# EAGLE design MFOS Dual VCA Sliders (EAGLE 7.6.0)
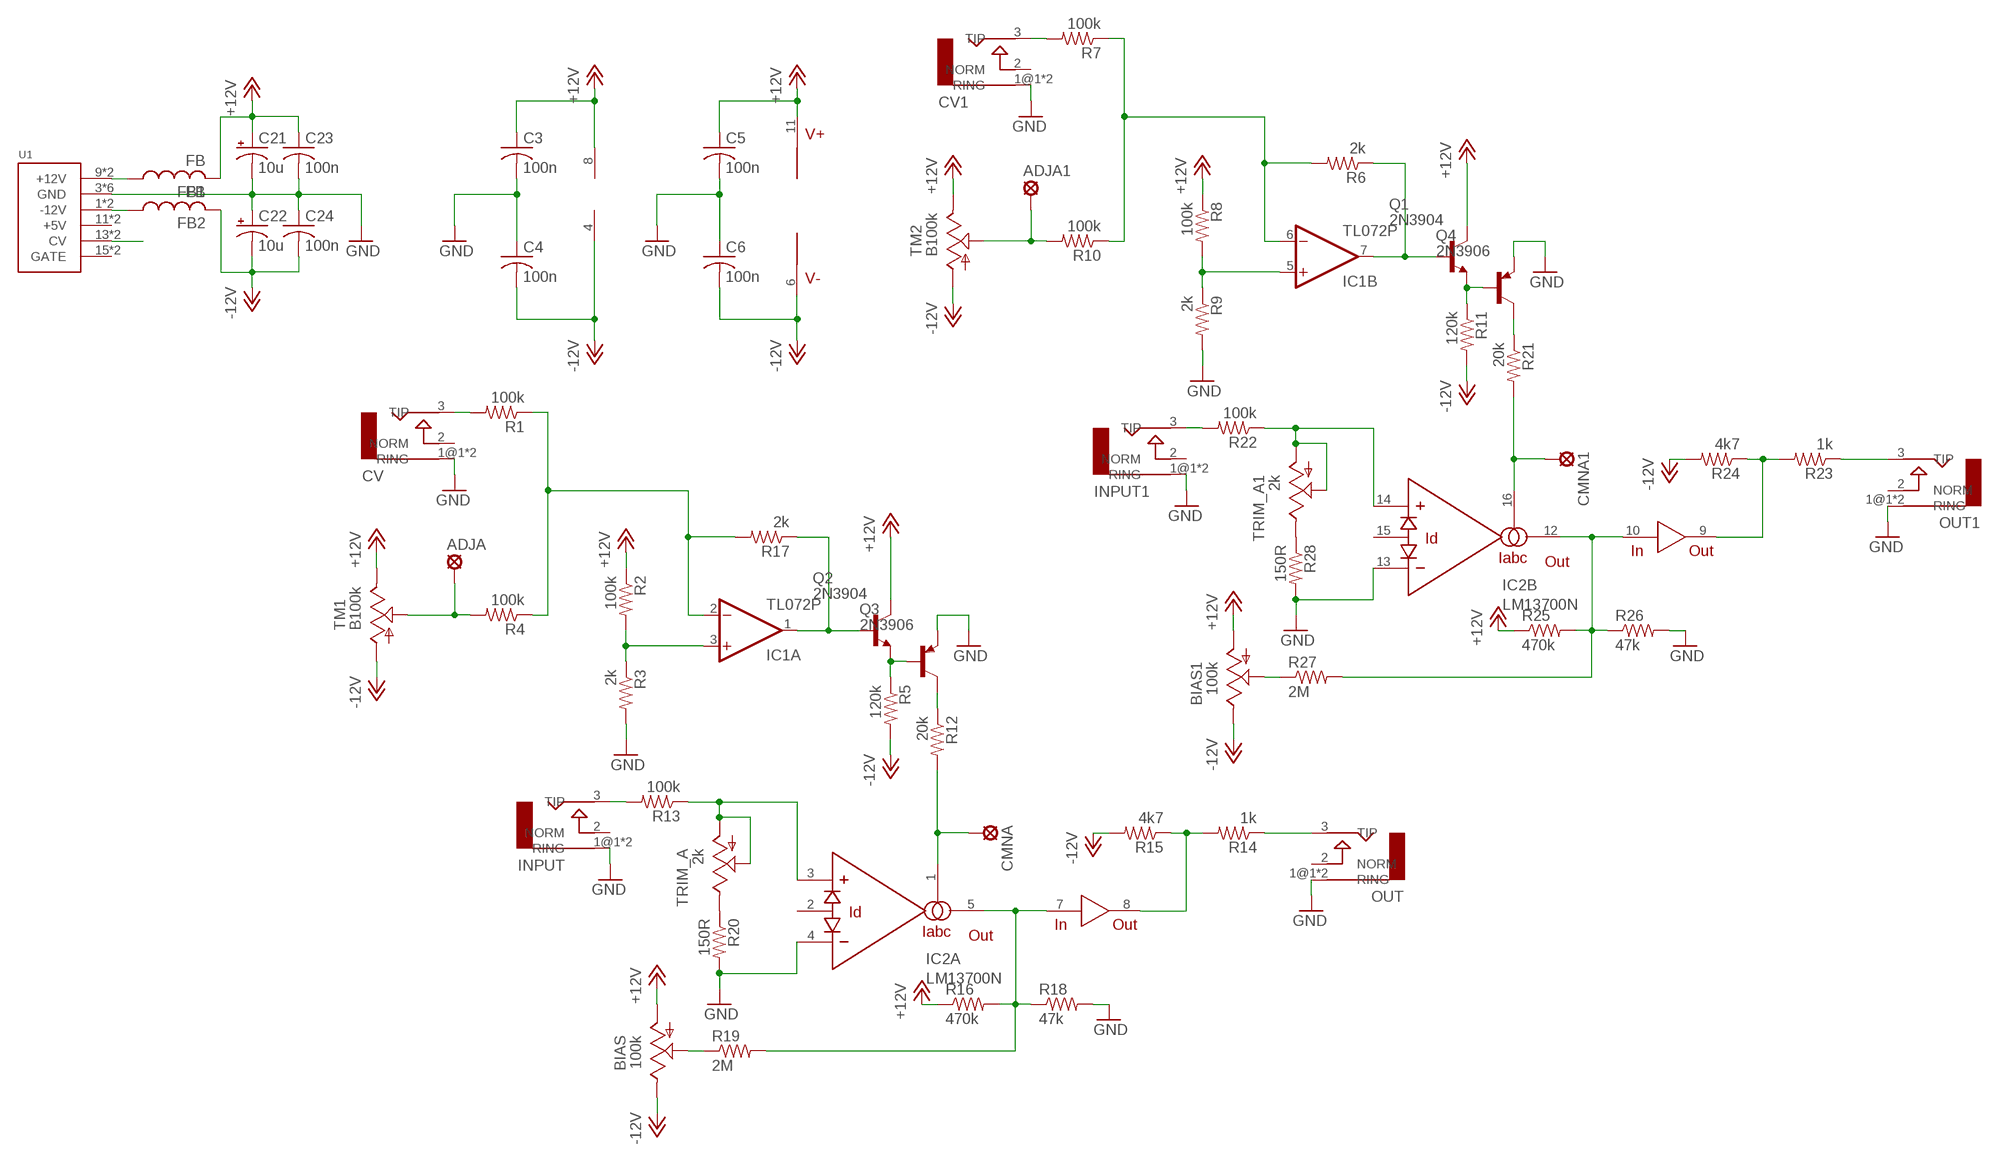
[diagram p0: schematic, sheet 1]

## Parts
ADJA  LSP10  [LSP10]
ADJA1  LSP10  [LSP10]
BIAS  100k  TRIM_US-B64W  [B64W]
BIAS1  100k  TRIM_US-B64W  [B64W]
C3  100n  C-USC1206  [C1206]
C4  100n  C-USC1206  [C1206]
C5  100n  C-USC1206  [C1206]
C6  100n  C-USC1206  [C1206]
C21  10u  CPOL-USB45181A  [B45181A]
C22  10u  CPOL-USB45181A  [B45181A]
C23  100n  C-US050-024X044  [C050-024X044]
C24  100n  C-US050-024X044  [C050-024X044]
CMNA  LSP10  [LSP10]
CMNA1  LSP10  [LSP10]
CV  AUDIO-JACKERTHENVAR  [ERTHENVAR-JACK]
CV1  AUDIO-JACKERTHENVAR  [ERTHENVAR-JACK]
FB1  FB  [FB]
FB2  FB  [FB]
IC1  TL072P  [DIL08]
IC2  LM13700N  [DIL16]
INPUT  AUDIO-JACKERTHENVAR  [ERTHENVAR-JACK]
INPUT1  AUDIO-JACKERTHENVAR  [ERTHENVAR-JACK]
OUT  AUDIO-JACKERTHENVAR  [ERTHENVAR-JACK]
OUT1  AUDIO-JACKERTHENVAR  [ERTHENVAR-JACK]
Q1  2N3904  [TO92]
Q2  2N3904  [TO92]
Q3  2N3906  [TO92]
Q4  2N3906  [TO92]
R1  100k  R-US_R1206  [R1206]
R2  100k  R-US_R1206  [R1206]
R3  2k  R-US_R1206  [R1206]
R4  100k  R-US_R1206  [R1206]
R5  120k  R-US_R1206  [R1206]
R6  2k  R-US_R1206  [R1206]
R7  100k  R-US_R1206  [R1206]
R8  100k  R-US_R1206  [R1206]
R9  2k  R-US_R1206  [R1206]
R10  100k  R-US_R1206  [R1206]
R11  120k  R-US_R1206  [R1206]
R12  20k  R-US_R1206  [R1206]
R13  100k  R-US_R1206  [R1206]
R14  1k  R-US_R1206  [R1206]
R15  4k7  R-US_R1206  [R1206]
R16  470k  R-US_R1206  [R1206]
R17  2k  R-US_R1206  [R1206]
R18  47k  R-US_R1206  [R1206]
R19  2M  R-US_R1206  [R1206]
R20  150R  R-US_R1206  [R1206]
R21  20k  R-US_R1206  [R1206]
R22  100k  R-US_R1206  [R1206]
R23  1k  R-US_R1206  [R1206]
R24  4k7  R-US_R1206  [R1206]
R25  470k  R-US_R1206  [R1206]
R26  47k  R-US_R1206  [R1206]
R27  2M  R-US_R1206  [R1206]
R28  150R  R-US_R1206  [R1206]
TM1  B100k  TRIMSLIDE60  [SLIDEPOT-60]
TM2  B100k  TRIMSLIDE60  [SLIDEPOT-60]
TRIM_A  2k  TRIM_US-B64W  [B64W]
TRIM_A1  2k  TRIM_US-B64W  [B64W]
U1  POWER  [POWER_16]

## Nets
+12V: BIAS1.A BIAS.A C3.1 C5.1 C21.+ C23.1 FB1.P$2 IC1.8(P:V+) IC2.11(V+) Q1.1(C) Q2.1(C) R2.1 R8.1 R16.1 R25.1 TM1.B TM2.B
-12V: BIAS1.E BIAS.E C4.2 C6.2 C22.- C24.2 FB2.P$2 IC1.4(P:V-) IC2.6(V-) R5.2 R11.2 R15.2 R24.2 TM1.A TM2.A
GND: C3.2 C4.1 C5.2 C6.1 C21.- C22.+ C23.2 C24.1 CV1.1@1(RING) CV1.1@2(RING) CV.1@1(RING) CV.1@2(RING) IC2.4(A:-IN) IC2.13(B:-IN) INPUT1.1@1(RING) INPUT1.1@2(RING) INPUT.1@1(RING) INPUT.1@2(RING) OUT1.1@1(RING) OUT1.1@2(RING) OUT.1@1(RING) OUT.1@2(RING) Q3.3(E) Q4.3(E) R3.2 R9.2 R18.2 R20.2 R26.2 R28.2 U1.3(GND) U1.4(GND) U1.5(GND) U1.6(GND) U1.7(GND) U1.8(GND)
N$1: IC1.7(B:OUT) Q1.2(B) R6.1
N$2: IC1.5(B:+IN) R8.2 R9.1
N$3: CV.3(TIP) R1.2
N$4: CV1.3(TIP) R7.2
N$5: ADJA.MP R4.2 TM1.WIPER
N$6: IC1.2(A:-IN) R1.1 R4.1 R17.2
N$7: Q2.3(E) Q3.2(B) R5.1
N$8: IC1.1(A:OUT) Q2.2(B) R17.1
N$9: ADJA1.MP R10.2 TM2.WIPER
N$10: IC1.6(B:-IN) R6.2 R7.1 R10.1
N$11: IC1.3(A:+IN) R2.2 R3.1
N$12: Q3.1(C) R12.1
N$13: INPUT.3(TIP) R13.2
N$14: Q1.3(E) Q4.2(B) R11.1
N$15: Q4.1(C) R21.1
N$16: CMNA.MP IC2.1(A:IABC) R12.2
N$17: INPUT1.3(TIP) R22.2
N$18: BIAS.P$1(S) BIAS.S R19.1
N$19: OUT.3(TIP) R14.1
N$20: IC2.8(OUT) R14.2 R15.1
N$21: IC2.5(A:OUT) IC2.7(IN) R16.2 R18.1 R19.2
N$22: R20.1 TRIM_A.E
N$23: IC2.3(A:+IN) R13.1 TRIM_A.A TRIM_A.P$1(S) TRIM_A.S
N$24: CMNA1.MP IC2.16(B:IABC) R21.2
N$25: IC2.9(OUT) R23.2 R24.1
N$26: OUT1.3(TIP) R23.1
N$27: IC2.10(IN) IC2.12(B:OUT) R25.2 R26.1 R27.2
N$28: BIAS1.P$1(S) BIAS1.S R27.1
N$29: R28.1 TRIM_A1.E
N$30: IC2.14(B:+IN) R22.1 TRIM_A1.A TRIM_A1.P$1(S) TRIM_A1.S
N$55: U1.13(CV) U1.14(CV)
N$61: FB1.P$1 U1.9(+12V) U1.10(+12V)
N$62: FB2.P$1 U1.1(-12V) U1.2(-12V)
Unconnected: CV1.2(NORM) CV.2(NORM) IC2.2(A:ID) IC2.15(B:ID) INPUT1.2(NORM) INPUT.2(NORM) OUT1.2(NORM) OUT.2(NORM) U1.11(+5V) U1.12(+5V) U1.15(GATE) U1.16(GATE)

## Library data of the parts
ADJA ADJA1 CMNA CMNA1 = solpad:LSP10: SOLDER PAD drill 1.0 mm, distributor Buerklin, 12H555
BIAS BIAS1 TRIM_A TRIM_A1 = pot:TRIM_US-: POTENTIOMETER
C3-C6 C23 C24 = rcl:C-US: CAPACITOR, American symbol
C21 C22 = rcl:CPOL-US: POLARIZED CAPACITOR, American symbol
CV CV1 INPUT INPUT1 OUT OUT1 = erthenvar:AUDIO-JACK: Switching Mono 3.5mm Audio Jack from Erthenvar.
FB1 FB2 = adafruit:FB: Ferrite bead Digikey #P9821BK-ND
IC1 = linear:TL072: OP AMP
IC2 = synthdiy updated imperial:LM13700: National Dual OTA with buffers.
Q1 Q2 = transistor-npn:2N3904: NPN Transistor
Q3 Q4 = transistor-pnp:2N3906: PNP Transistor
R1-R28 = rcl:R-US_: RESISTOR, American symbol
TM1 TM2 = stefan-lochbrunner_EAGLE_master_custom libraries_potentiometers_Bourns PTA series_Bourns PTA series:TRIM: Sliding potentiometers Based on Adafruits (https://github.com/adafruit/Adafruit-Eagle-Library) 'TRIM' device. For Bourns PTA series and TT Electronics PSxx series potentiometers.
U1 = eurorack:POWER

## Board
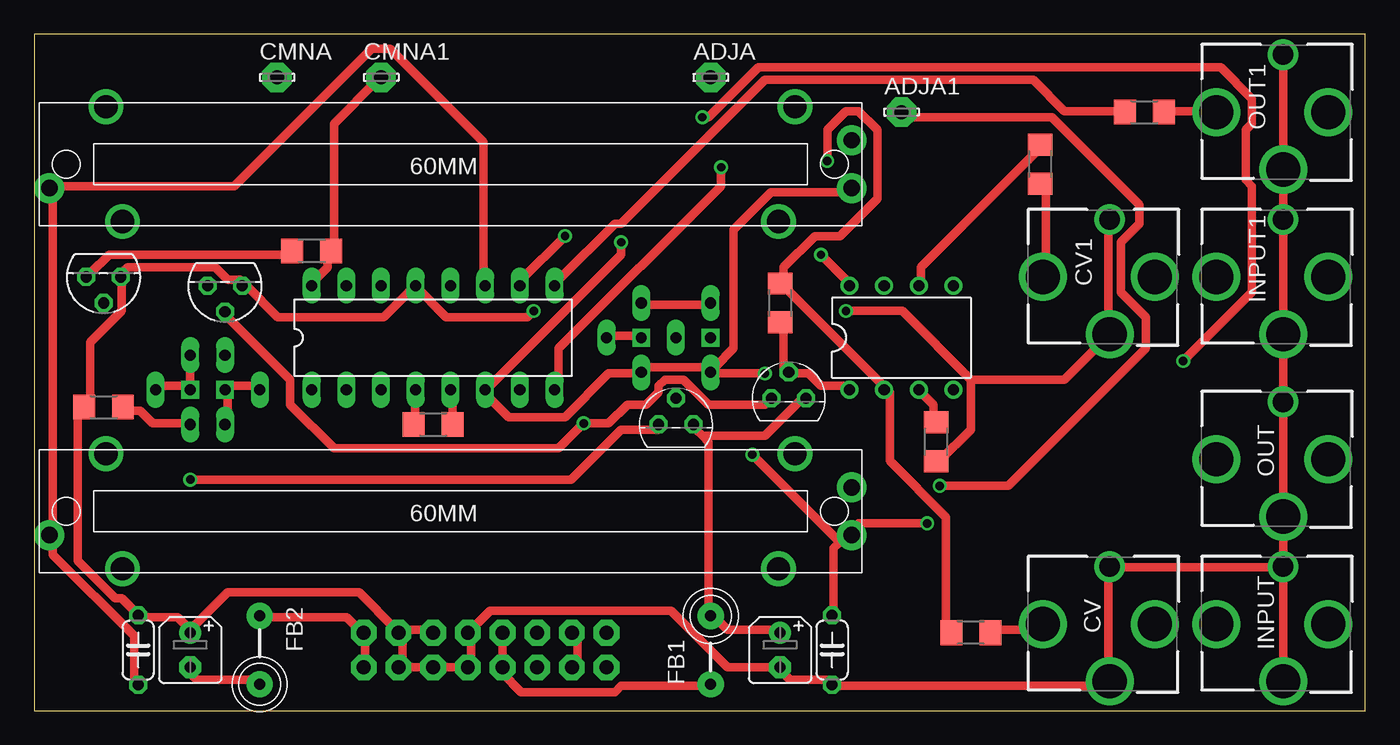
[diagram p1: board, top side]
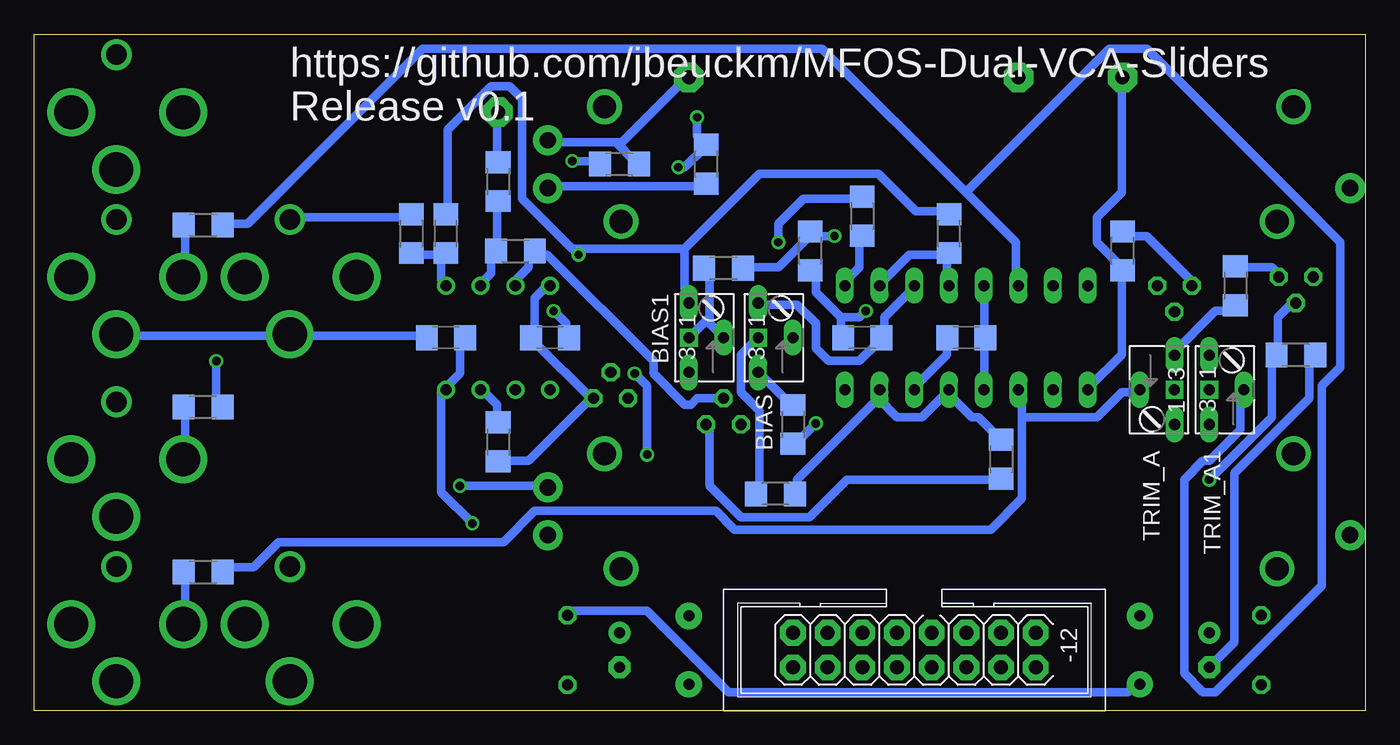
[diagram p2: board, bottom side, seen from below]

Size 97.46 x 49.52 mm. Coordinates in mm from the lower left corner, seen from the top.
Outline: 0,0 97.46,0 97.46,49.52 0,49.52 0,0
Copper layers (1*16): Top 0.035mm / dielectric 1.5mm / Bottom 0.035mm
Design rules "default *": minimum track width 24mil, minimum drill 24mil, track to track 12mil, track to pad 12mil, pad to pad 12mil, via to via 12mil, smd to smd 8mil, copper to edge 10mil, drill to drill 8mil, minimum pad ring 10mil, minimum via ring 8mil, stop-mask expansion 4mil, vias tented up to drill 0mil, thermal gap 10mil

### Footprints (pad centres in the part's own frame; a part is rotated, then mirrored left to right if it is on the bottom)
LSP10 = drill 1.016 pad 2.159 octagon: MP 0,0
B64W = drill 0.813 long: A 2.54,0; E -2.54,0; S 0,-2.54 | drill 0.8 square: P$1 0,0
C1206 = smd 1.6 x 1.8: 1 -1.4,0; 2 1.4,0
B45181A = drill 0.813 pad 1.6: + -1.27,0 | drill 0.813 pad 1.6 octagon: - 1.27,0
C050-024X044 = drill 0.813 octagon: 1 -2.54,0; 2 2.54,0
ERTHENVAR-JACK = drill 2.5: 1@1 -4.2,0; 2 0,-3.3; 3 0,4.9 | drill 1.5: 1@2 4.2,0
FB = drill 0.8 pad 1.93: P$1 -2.5,0; P$2 2.5,0
DIL08 = drill 0.813 pad 1.27: 1 -3.81,-3.81; 2 -1.27,-3.81; 3 1.27,-3.81; 4 3.81,-3.81; 5 3.81,3.81; 6 1.27,3.81; 7 -1.27,3.81; 8 -3.81,3.81
DIL16 = drill 0.813 long: 1 -8.89,-3.81; 2 -6.35,-3.81; 3 -3.81,-3.81; 4 -1.27,-3.81; 5 1.27,-3.81; 6 3.81,-3.81; 7 6.35,-3.81; 8 8.89,-3.81; 9 8.89,3.81; 10 6.35,3.81; 11 3.81,3.81; 12 1.27,3.81; 13 -1.27,3.81; 14 -3.81,3.81; 15 -6.35,3.81; 16 -8.89,3.81
TO92 = drill 0.813 octagon: 1 1.27,0; 2 0,1.905; 3 -1.27,0
R1206 = smd 1.6 x 1.803: 1 -1.422,0; 2 1.422,0
SLIDEPOT-60 = drill 1.2 pad 2.184: A -29.37,1.75; B 29.37,1.75; WIPER -29.37,-1.75 | drill 1.7 pad 2.54: P$1 -24.02,4.2; P$2 24.02,4.2; P$3 -25.22,-4.2; P$4 25.22,-4.2
POWER_16 = drill 1.016 pad 1.88 octagon: 1 -6.35,-1.27; 2 -6.35,1.27; 3 -3.81,-1.27; 4 -3.81,1.27; 5 -1.27,-1.27; 6 -1.27,1.27; 7 1.27,-1.27; 8 1.27,1.27; 9 3.81,-1.27; 10 3.81,1.27; 11 6.35,-1.27; 12 6.35,1.27; 13 8.89,-1.27; 14 8.89,1.27; 15 11.43,-1.27; 16 11.43,1.27

### Placement (x,y rotation side)
ADJA  49.53,46.35 0 top
ADJA1  63.5,43.81 0 top
BIAS  44.45,27.3 90 bottom
BIAS1  49.53,27.3 90 bottom
C3  59.69,27.3 0 bottom
C4  67.31,27.3 0 bottom
C5  36.83,27.3 180 bottom
C6  29.21,27.3 180 bottom
C21  54.61,4.45 270 top
C22  11.43,4.45 270 top
C23  7.62,4.45 90 top
C24  58.42,4.45 90 top
CMNA  17.78,46.35 0 top
CMNA1  25.4,46.35 0 top
CV  78.74,6.35 90 top
CV1  78.74,31.75 90 top
FB1  49.53,4.45 90 top
FB2  16.51,4.45 270 top
IC1  63.5,27.3 0 top
IC2  29.21,27.3 0 top
INPUT  91.44,6.35 90 top
INPUT1  91.44,31.75 90 top
OUT  91.44,18.41 90 top
OUT1  91.44,43.81 90 top
Q1  46.99,20.95 0 top
Q2  55.24,22.86 0 top
Q3  13.97,31.11 180 top
Q4  5.08,31.75 180 top
R1  68.58,5.71 0 top
R2  63.5,19.68 90 bottom
R3  66.04,19.68 270 top
R4  54.61,40.01 0 bottom
R5  41.91,20.95 90 bottom
R6  62.23,33.66 180 bottom
R7  73.66,40.01 270 top
R8  67.31,34.92 270 bottom
R9  69.85,34.92 90 bottom
R10  63.5,38.73 90 bottom
R11  5.08,26.04 0 bottom
R12  17.78,33.66 270 bottom
R13  85.09,10.16 180 bottom
R14  85.09,22.23 0 bottom
R15  48.26,40.01 270 bottom
R16  26.67,18.41 90 bottom
R17  54.61,29.84 90 top
R18  29.21,20.95 180 top
R19  43.18,15.88 0 bottom
R20  9.53,31.11 90 bottom
R21  20.32,33.66 0 top
R22  85.09,35.56 180 bottom
R23  81.28,43.81 180 top
R24  36.83,36.2 90 bottom
R25  30.48,34.92 270 bottom
R26  40.64,33.66 270 bottom
R27  46.99,32.38 0 bottom
R28  5.08,22.23 180 top
TM1  30.48,40.01 180 top
TM2  30.48,14.61 180 top
TRIM_A  13.97,23.5 270 bottom
TRIM_A1  11.43,23.5 90 bottom
U1  30.48,4.45 180 bottom

### Tracks (layer width: path | path; a pad name or v marks a point on that pad's centre or on a via)
+12V  (via drill 0.61)
  Top 0.61: C21.+ 54.41,5.94 50.75,5.94 49.84,6.86 FB1.P$2 49.38,7.32 49.38,19.66 48.92,20.12 | 48.92,20.12 48.46,20.57 Q1.1 | 48.92,20.12 53.49,20.12 56.24,22.86 Q2.1 | C23.1 7.32,2.29 7.32,5.49 1.37,11.43 1.37,12.8 TM2.B 1.37,13.26 1.37,37.95 TM1.B 1.37,38.41 14.63,38.41 24.69,48.46 26.06,48.46 32.92,41.6 32.92,31.55 IC2.11 | BIAS.A 44.81,29.72 49.38,29.72 BIAS1.A | v57.61,33.38 59.44,31.55 IC1.8
  Bottom 0.61: IC1.8 59.89,31.09 60.81,30.18 60.81,27.43 C3.1 60.81,26.98 56.69,22.86 | 56.69,22.86 61.27,18.29 63.09,18.29 R2.1 | 56.69,22.86 Q2.1 | R16.1 26.98,16.92 37.95,16.92 40.69,14.17 45.72,14.17 48.01,16.46 48.01,20.57 Q1.1 | IC2.11 32.92,31.09 35.2,28.8 35.2,27.43 C5.1 35.66,26.98 37.03,25.6 39.32,25.6 40.23,26.52 40.23,28.35 41.6,29.72 44.35,29.72 BIAS.A | 49.84,33.83 44.35,39.32 35.66,39.32 32.92,36.58 30.63,36.58 R25.1 | 49.84,33.83 49.84,30.18 BIAS1.A | 49.84,33.83 57.61,33.83 | 57.61,33.83 58.06,33.83 61.72,37.49 61.72,44.81 62.64,45.72 64.01,45.72 67.21,42.52 67.21,36.58 R8.1 | 57.61,33.83 v57.61,33.38
-12V  (via drill 0.61)
  Top 0.61: BIAS1.E 49.38,25.15 44.81,25.15 BIAS.E 44.35,24.69 42.06,24.69 38.86,21.49 34.75,21.49 32.92,23.32 IC2.6 33.38,23.77 42.98,33.38 v42.98,34.29 | TM1.A 59.44,37.95 53.95,37.95 51.21,35.2 51.21,26.52 49.84,25.15 BIAS1.E | 58.98,12.34 59.44,12.8 TM2.A | 58.98,12.34 58.52,11.89 58.52,7.32 C24.2 | v65.38,13.72 60.35,13.72 59.89,13.26 TM2.A | FB2.P$2 16.46,2.29 11.89,2.29 11.43,2.74 C22.- | v53.49,24.69 49.84,24.69 BIAS1.E | 58.98,12.34 v52.58,18.75 | 58.98,12.34 TM2.A
  Bottom 0.61: R15.2 48.46,38.41 59.44,38.41 TM1.A | R5.2 42.06,22.4 44.35,24.69 BIAS.E | C6.2 30.63,26.98 30.63,26.06 32.92,23.77 IC2.6 | v42.98,34.29 42.98,35.66 41.15,37.49 37.03,37.49 R24.2 | C4.2 66.29,26.98 66.29,24.69 67.21,23.77 IC1.4 67.67,23.32 67.67,16 v65.38,13.72 | R11.2 4.12,25.6 4.12,22.86 9.6,17.37 9.6,5.03 11.43,3.2 C22.- | C24.2 58.06,7.32 52.58,7.32 46.63,1.37 17.37,1.37 16.92,1.83 FB2.P$2 | v53.49,24.69 52.58,23.77 v52.58,18.75
GND  (via drill 0.61)
  Top 0.61: R18.2 27.89,21.03 27.89,23.32 IC2.4 | v36.58,29.26 36.12,28.8 30.18,28.8 27.89,31.09 | 26.98,3.2 28.8,3.2 U1.6 29.26,3.2 31.55,3.2 U1.8 32,3.2 32,5.49 U1.7 32,5.94 33.38,7.32 46.63,7.32 50.75,3.2 54.41,3.2 C21.- 54.86,2.74 55.32,2.29 58.06,2.29 C24.1 58.52,1.83 78.64,1.83 CV.1@1 78.64,2.29 78.64,10.52 CV.1@2 79.1,10.52 91.44,10.52 | U1.3 26.98,5.94 28.8,5.94 U1.5 | 26.98,3.2 26.98,5.49 U1.3 | 26.98,3.2 U1.4 | 11.43,5.94 10.52,6.86 7.77,6.86 C23.2 7.32,7.32 6.4,8.23 5.94,8.23 3.2,10.97 3.2,21.49 3.66,21.95 R28.2 4.12,22.4 4.12,26.98 6.4,29.26 6.4,31.55 Q4.3 6.4,32 6.86,32.46 13.26,32.46 14.17,31.55 15.09,31.55 Q3.3 15.54,31.09 17.83,28.8 25.6,28.8 27.89,31.09 | 11.43,5.94 14.17,8.69 23.77,8.69 26.52,5.94 U1.3 | 11.43,5.94 C22.+ | 27.89,31.09 IC2.13 | v59.44,29.26 63.55,29.26 68.58,24.23 | 68.58,24.23 68.58,20.57 66.29,18.29 R3.2 | CV1.1@2 78.64,35.66 78.64,27.89 CV1.1@1 78.64,27.43 75.44,24.23 68.58,24.23 | OUT1.1@2 OUT1.1@1 INPUT1.1@2 INPUT1.1@1 OUT.1@2 OUT.1@1 INPUT.1@2 91.44,10.52 | 91.44,10.52 INPUT.1@1
  Bottom 0.61: 38.41,28.8 38.41,27.43 C5.2 | 38.41,28.8 40.23,30.63 40.23,32 R26.2 | IC2.4 27.89,23.77 27.89,26.98 C6.1 27.89,27.43 27.89,31.09 IC2.13 | 38.41,28.8 37.03,28.8 v36.58,29.26 | R20.2 9.14,32.46 6.86,32.46 6.4,32 Q4.3 | v59.44,29.26 58.52,28.35 58.52,27.43 C3.2 | R9.2 69.95,36.12 78.64,36.12 CV1.1@2 | C4.1 69.04,27.43 78.64,27.43 CV1.1@1 79.1,27.43 91.44,27.43 INPUT1.1@1
N$1
  Bottom 0.61: IC1.7 62.18,31.55 61.27,32.46 61.27,33.38 R6.1 60.81,33.38 59.89,33.38 52.12,25.6 52.12,24.69 49.84,22.4 49.38,22.4 48.92,22.86 Q1.2
N$2
  Bottom 0.61: 67.67,33.38 69.49,33.38 R9.1 | 67.67,33.38 67.67,31.55 IC1.5 | 67.67,33.38 R8.2
N$3
  Top 0.61: R1.2 70.41,5.94 73.61,5.94 CV.3
N$4
  Top 0.61: R7.2 74.07,38.41 74.07,32 CV1.3
N$5
  Bottom 0.61: 54.86,41.6 53.49,40.23 R4.2 | 54.86,41.6 59.44,41.6 TM1.WIPER | 54.86,41.6 54.41,41.6 49.84,46.18 ADJA.MP
N$6  (via drill 0.61)
  Top 0.61: R1.1 66.75,5.94 66.75,14.17 62.64,18.29 62.64,23.32 IC1.2 62.18,23.77 54.86,31.09 R17.2 54.86,31.55 54.86,32.46 57.15,34.75 58.98,34.75 61.72,37.49 61.72,42.52 60.35,43.89 59.44,43.89 58.06,42.52 v58.06,40.23
  Bottom 0.61: v58.06,40.23 56.24,40.23 R4.1
N$7  (via drill 0.61)
  Top 0.61: Q2.3 53.95,22.86 53.49,22.4 49.38,22.4 47.55,24.23 46.18,24.23 45.72,23.77 45.72,23.32 44.81,22.4 43.43,22.4 42.06,21.03 v40.23,21.03 38.41,19.2 21.95,19.2 18.75,22.4 18.75,24.23 14.17,28.8 Q3.2
  Bottom 0.61: v40.23,21.03 41.6,19.66 R5.1
N$8
  Top 0.61: R17.1 54.86,28.35 54.86,25.15 Q2.2 55.32,24.69 56.69,24.69 57.61,23.77 59.44,23.77 IC1.1
N$9  (via drill 0.61)
  Top 0.61: v66.29,16.46 71.32,16.46 81.38,26.52 81.38,28.8 79.55,30.63 79.55,34.29 80.92,35.66 80.92,37.03 74.52,43.43 63.55,43.43 ADJA1.MP
  Bottom 0.61: R10.2 63.55,40.23 63.55,43.43 ADJA1.MP | v66.29,16.46 59.89,16.46 TM2.WIPER
N$10
  Top 0.61: R7.1 73.61,41.15 64.92,32.46 64.92,31.55 IC1.6
  Bottom 0.61: IC1.6 64.47,31.55 64.01,32 64.01,33.38 R6.2 63.55,33.83 63.55,37.03 R10.1
N$11
  Top 0.61: R3.1 65.84,21.49 65.84,22.4 64.92,23.32 IC1.3
  Bottom 0.61: R2.2 63.55,21.49 63.55,22.4 64.47,23.32 IC1.3
N$12
  Bottom 0.61: R12.1 17.37,34.75 16,34.75 12.8,31.55 Q3.1
N$13
  Bottom 0.61: R13.2 86.41,10.06 86.41,6.4 INPUT.3
N$14  (via drill 0.61)
  Top 0.61: v11.43,16.92 39.32,16.92 42.98,20.57 45.72,20.57 Q1.3
  Bottom 0.61: Q4.2 5.49,29.72 6.4,28.8 6.4,26.06 R11.1 6.86,25.6 6.86,21.49 v11.43,16.92
N$15
  Top 0.61: R21.1 18.75,33.38 5.49,33.38 4.12,32 Q4.1
N$16
  Bottom 0.61: IC2.1 20.12,23.77 17.83,26.06 17.83,32 R12.2 17.83,32.46 19.66,34.29 19.66,36.12 17.83,37.95 17.83,46.18 CMNA.MP
N$17
  Bottom 0.61: R22.2 86.41,35.2 86.41,32 INPUT1.3
N$18
  Top 0.61: BIAS.S 42.06,27.43 44.35,27.43 BIAS.P$1
  Bottom 0.61: R19.1 44.35,16 44.35,21.95 45.72,23.32 45.72,26.06 44.81,26.98 BIAS.P$1
N$19
  Bottom 0.61: R14.1 86.41,21.95 86.41,18.75 OUT.3
N$20  (via drill 0.61)
  Top 0.61: v50.29,39.78 50.29,38.41 38.41,26.52 38.41,23.77 IC2.8 | v84.12,25.6 89.15,30.63 89.15,38.41 88.7,38.86 88.7,42.52 89.15,42.98 89.15,44.81 86.87,47.09 53.03,47.09 49.38,43.43 v48.92,43.43
  Bottom 0.61: v50.29,39.78 49.84,39.78 48.46,41.15 R15.1 48.46,41.6 48.92,42.06 v48.92,43.43 | v84.12,25.6 84.12,22.4 R14.2
N$21
  Top 0.61: R18.1 30.63,21.03 30.63,23.32 IC2.5
  Bottom 0.61: 30.63,23.32 28.8,21.49 28.35,21.49 26.98,20.12 R16.2 | 35.66,22.86 35.2,23.32 IC2.7 35.66,22.86 | 35.66,22.86 41.6,16.92 41.6,16 R19.2 | 30.63,23.32 32.46,21.49 34.29,21.49 35.66,22.86 | 30.63,23.32 IC2.5
N$22
  Bottom 0.61: R20.1 9.6,29.26 10.97,29.26 14.17,26.06 TRIM_A.E
N$23
  Top 0.61: TRIM_A.S 16.46,23.77 14.17,23.77 TRIM_A.P$1 14.17,23.32 14.17,21.03 TRIM_A.A
  Bottom 0.61: 25.15,21.49 25.15,23.32 IC2.3 | 25.15,21.49 25.15,15.54 27.43,13.26 46.18,13.26 47.55,14.63 60.81,14.63 63.09,12.34 79.55,12.34 81.38,10.52 83.67,10.52 R13.1 | 25.15,21.49 19.66,21.49 17.83,23.32 16.92,23.32 TRIM_A.S
N$24
  Top 0.61: IC2.16 20.57,31.55 21.49,32.46 21.49,33.38 R21.2 21.95,33.83 21.95,42.98 25.15,46.18 CMNA1.MP
N$25
  Top 0.61: R23.2 79.55,43.89 75.44,43.89 73.15,46.18 53.49,46.18 42.98,35.66 42.52,35.66 38.41,31.55 IC2.9
  Bottom 0.61: R24.1 37.03,34.75 37.03,32.46 37.95,31.55 IC2.9
N$26
  Top 0.61: R23.1 82.75,43.89 86.41,43.89 OUT1.3
N$27  (via drill 0.61)
  Top 0.61: v38.86,34.75 35.66,31.55 IC2.10
  Bottom 0.61: R27.2 45.26,32.46 42.98,32.46 40.69,34.75 R26.1 40.23,34.75 v38.86,34.75 | 30.63,33.38 30.63,31.55 IC2.12 | 30.63,33.38 33.38,33.38 35.2,31.55 IC2.10 | 30.63,33.38 R25.2
N$28
  Bottom 0.61: 48.01,28.8 48.01,28.35 47.09,27.43 BIAS1.S | 48.01,28.8 48.01,32 R27.1 | 48.01,28.8 49.38,27.43 BIAS1.P$1
N$29
  Top 0.61: R28.1 6.86,21.95 7.77,21.95 8.69,21.03 11.43,21.03 TRIM_A1.E
N$30
  Top 0.61: TRIM_A1.A 11.43,23.77 | 11.43,23.77 9.14,23.77 TRIM_A1.S | 11.43,23.77 TRIM_A1.P$1
  Bottom 0.61: 29.26,37.95 25.6,34.29 25.6,31.55 IC2.14 | 29.26,37.95 39.78,48.46 69.04,48.46 81.84,35.66 83.67,35.66 R22.1 | 29.26,37.95 18.75,48.46 16,48.46 1.83,34.29 1.83,25.15 3.2,23.77 3.2,9.14 10.97,1.37 11.89,1.37 13.26,2.74 13.26,16.92 11.89,18.29 11.43,18.29 9.14,20.57 9.14,23.32 TRIM_A1.S
N$55
  Top 0.61: U1.14 39.78,3.2 39.78,5.49 U1.13
N$61
  Top 0.61: U1.9 U1.10 34.29,2.74 35.66,1.37 42.52,1.37 42.98,1.83 49.38,1.83 FB1.P$1
N$62
  Top 0.61: U1.2 24.23,3.2 24.23,5.49 U1.1 23.77,5.94 22.86,6.86 16.92,6.86 FB2.P$1

### Text on the board
bNames: https://github.com/jbeuckm/MFOS-Dual-VCA-Sliders | Release v0.1